# Altium schematic sheet GPS.SchDoc
size A4; SheetNumber: 2; SheetTotal: 4
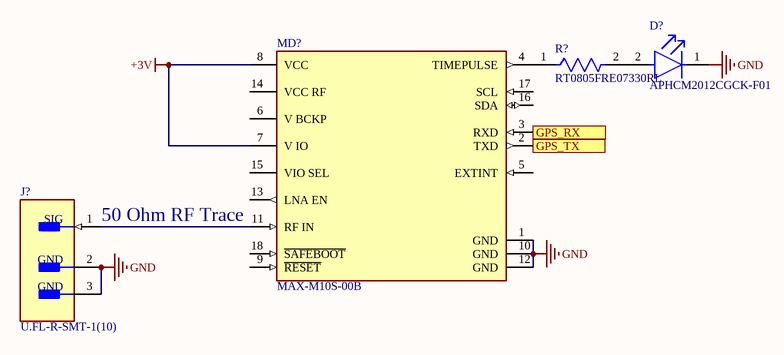
[diagram p0: GPS.SchDoc]

## Parts
D?  APHCM2012CGCK-F01  [FP-APHCM2012CGCK-F01-MFG]
J?  U.FL-R-SMT-1(10)  [FP-U_FL-R-SMT-1_10-MFG]
MD?  MAX-M10S-00B  [FP-MAX-M10S-00B-MFG]
R?  RT0805FRE07330RL  [FP-RT0805-MFG]

## Ports
GPS_RX (in), GPS_TX (out)

## Nets
+3V: MD?.7(V_IO) MD?.8(VCC)
GND: D?.1(C) J?.2(GND) J?.3(GND) MD?.1(GND) MD?.10(GND) MD?.12(GND)
GPS_RX: MD?.3(RXD) ; port GPS_RX
GPS_TX: MD?.2(TXD) ; port GPS_TX
NetD?_2: D?.2(A) R?.2
NetJ?_1: J?.1(SIG) MD?.11(RF_IN)
NetMD?_4: MD?.4(TIMEPULSE) R?.1

Not connected (* = marked no-connect by the designer): MD? 5(EXTINT) 6(V_BCKP) 9(~{RESET}) 13(LNA_EN) 14(VCC_RF) 15(VIO_SEL) 16(SDA) 17(SCL) 18(~{SAFEBOOT})

## Notes on the sheet
- 50 Ohm RF Trace

## Library data of the parts
D? = CMP-44529-000062-1: LED GREEN CLEAR CHIP SMD; Dominant Wavelength: 570nm; Forward Current: 20mA; Number of LEDs: 1; Luminous Intensity: 40mcd; Forward Voltage: 2.1V; Viewing Angle: 110°; Illumination Color: Green; Lens Style: Clear; Mount: Surface Mount; Length: 2mm; Max Operating Temperature: 85°C; Series: APHCM; Width: 1.25mm; Lead Free: Lead Free; Wavelength: 570nm; Package Quantity: 1; Number of Pins: 2; Case Code (Metric): 2012; RoHS Compliant: Yes; Packaging: Tape and Reel; Lens Color: Clear; Case/Package: 0805; Case Code (Imperial): 0805; Test Current: 20mA; Color: Green; Min Operating Temperature: -40°C; Height: 0.4mm
J? = CMP-2000-05152-3: CONN U.FL RCPT STR 50 OHM SMD; Max Frequency: 6GHz; Connector Type: Coaxial; Body Plating: Silver; Body Material: Bronze; Impedance: 50R; Dielectric Material: Polymer; Insulation Resistance: 500MR; Gender: Male; Packaging: Cut Tape; Length: 3mm; Package Quantity: 2500; Termination: Solder; Lead Free: Lead Free; Series: U.FL; Min Operating Temperature: -40°C; Fastening Type: Snap; Contact Material: Brass; Orientation: Straight; Wire/Cable Type: Coaxial; Frequency: 6GHz; Contact Plating: Gold; Depth: 3.1mm; Weight: 0.001764oz; Max Operating Temperature: 90°C; Radiation Hardening: No; REACH SVHC: No SVHC; Mount: Surface Mount; Housing Color: Beige
MD? = CMP-207130-000026-1: GNSS LCC RX, ROM, TCXO, LNA, SAW
R? = CMP-03412-000042-1: Res Thin Film 0805 330K Ohm 1% 1/8W ±50ppm/°C Molded SMD SMD Paper T/R; Manufacturer: Yageo; Resistance: 330Ω; Value: 330Ω; Power Rating: 0.125W; Tolerance: 0.0001; Voltage Rating: 150V; Manufacturer Part Number: RT0805FRE07330RL; Height: 0.6mm; Octopart: https://octopart.com/rt0805fre07330rl-yageo-39785396; Package: RT0805; Temperature: -55°C to +155°C; Category: Res; RoHS: TRUE; ComponentLink2Description: Datasheet; Automotive: No; Device Class L3: Chip SMD Resistors; Temperature Range High: +155°C; Device Class L1: Passive Components; Temperature Coefficient: 50 ppm/°C; Series: RT; Composition: Thin Film; Digikey Description: Res Thin Film 0805 330K Ohm 1% 1/8W ±50ppm/°C Molded SMD SMD Paper T/R; Mouser Description: Res Thin Film 0805 330K Ohm 1% 1/8W ±50ppm/°C Molded SMD SMD Paper T/R; Device Class L2: Resistors; Temperature Range Low: -55°C; Ipc Land Pattern Name: RESC200125X50; Lead Free: Yes; ComponentLink2URL: http://www.yageo.com/documents/recent/PYu-RT_1-to-0.01_RoHS_L_9.pdf; Footprint Url: http://www.yageo.com/exep/pages/download/literatures/PYu-R_Mount_10.pdf